# Altium schematic sheet SpW_Misc.SchDoc: SVPXFMC Carrier 3U
size 420 x 297 mm; CheckedBy: \; Author: G.Kasprowicz; CompanyName: ISE; DrawnBy: T.Przywozki; Organization: WUT ISE; Address1: Warsaw University of Technology; Address2: Nowowiejska 15/19 00-665 Warsaw; Revision: 1.0.; SheetNumber: 11; SheetTotal: 20; Project: SVPXFMC Carrier 3U; ModifiedBy: -; CheckedDate: -; Title2: FPGA SpaceWire; DivGrp: ISE; Designer: G. Kasprowicz
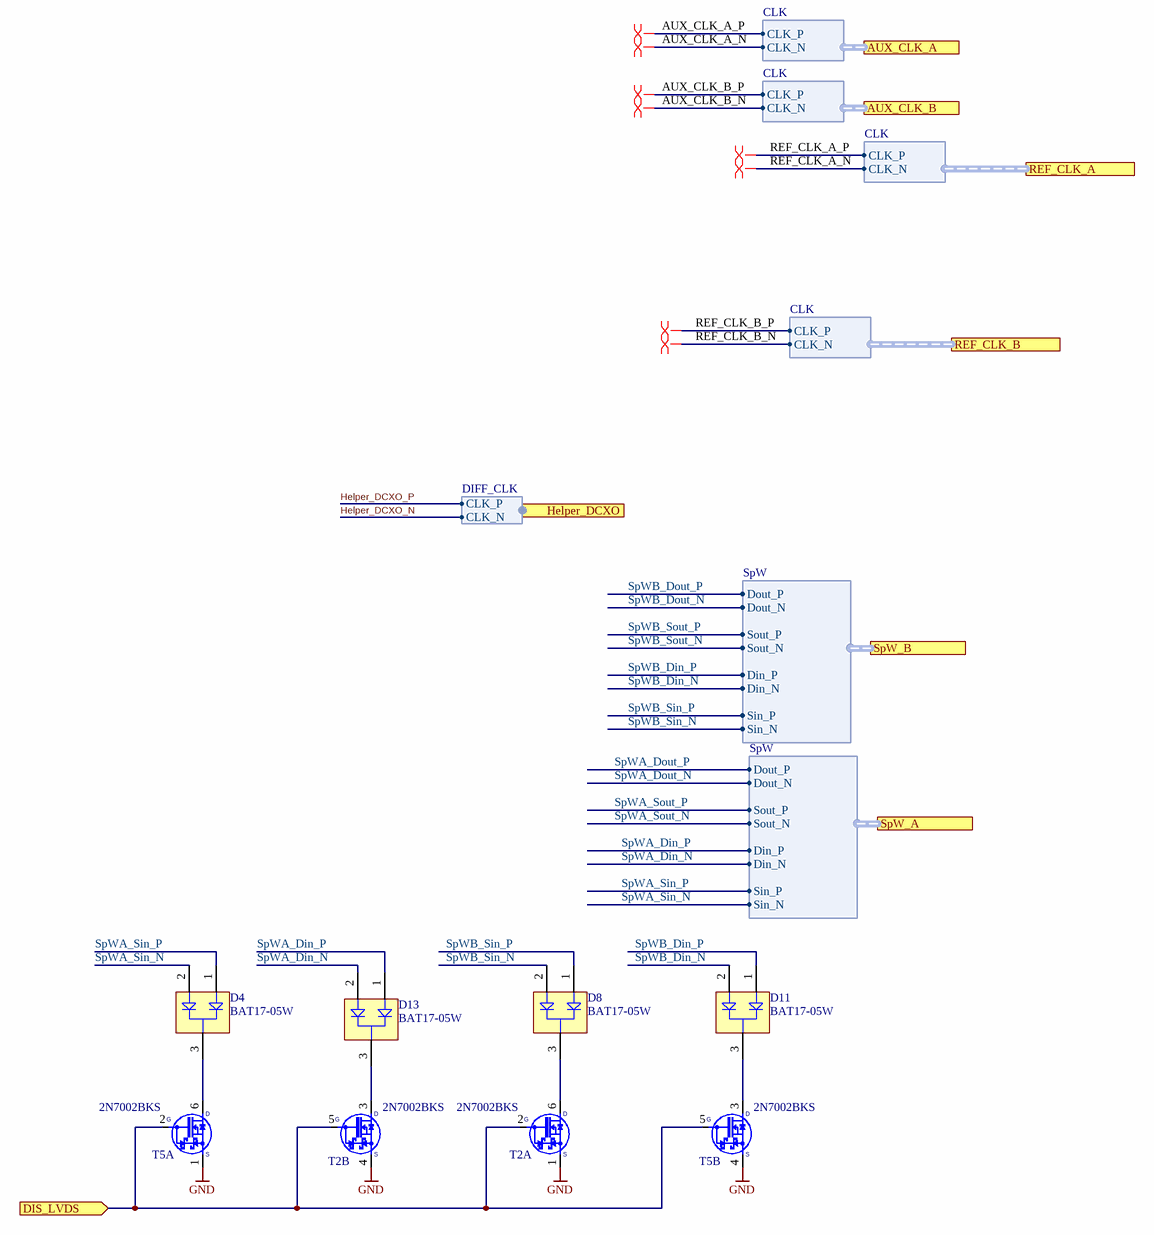
[diagram p0: SpW_Misc.SchDoc]

## Parts
D4  BAT17-05W  [INF-SOT323_N]
D8  BAT17-05W  [INF-SOT323_N]
D11  BAT17-05W  [INF-SOT323_N]
D13  BAT17-05W  [INF-SOT323_N]
T2  2N7002BKS  [SOT65P210X110-6N]  (parts A,B of 2)
T5  2N7002BKS  [SOT65P210X110-6N]  (parts A,B of 2)

## Ports
AUX_CLK_A (harness CLK), AUX_CLK_B (harness CLK), DIS_LVDS (in), Helper_DCXO (harness DIFF_CLK), REF_CLK_A (harness CLK), REF_CLK_B (harness CLK), SpW_A (harness SpW), SpW_B (harness SpW)

## Harnesses
SpW: Sout_P, Sout_N, Dout_P, Dout_N, Sin_P, Sin_N, Din_P, Din_N
CLK: CLK_P, CLK_N
DIFF_CLK: CLK_N, CLK_P

## Nets
GND: T2.1(S) T2.4(S) T5.1(S) T5.4(S)
AUX_CLK_A_N: port AUX_CLK_A.CLK_N
AUX_CLK_A_P: port AUX_CLK_A.CLK_P
AUX_CLK_B_N: port AUX_CLK_B.CLK_N
AUX_CLK_B_P: port AUX_CLK_B.CLK_P
DIS_LVDS: T2.2(G) T2.5(G) T5.2(G) T5.5(G) ; port DIS_LVDS
Helper_DCXO_N: port Helper_DCXO.CLK_N
Helper_DCXO_P: port Helper_DCXO.CLK_P
REF_CLK_A_N: port REF_CLK_A.CLK_N
REF_CLK_A_P: port REF_CLK_A.CLK_P
REF_CLK_B_N: port REF_CLK_B.CLK_N
REF_CLK_B_P: port REF_CLK_B.CLK_P
SpWA_Din_N: D13.2(A2) ; port SpW_A.Din_N
SpWA_Din_P: D13.1(A1) ; port SpW_A.Din_P
SpWA_Dout_N: port SpW_A.Dout_N
SpWA_Dout_P: port SpW_A.Dout_P
SpWA_Sin_N: D4.2(A2) ; port SpW_A.Sin_N
SpWA_Sin_P: D4.1(A1) ; port SpW_A.Sin_P
SpWA_Sout_N: port SpW_A.Sout_N
SpWA_Sout_P: port SpW_A.Sout_P
SpWB_Din_N: D11.2(A2) ; port SpW_B.Din_N
SpWB_Din_P: D11.1(A1) ; port SpW_B.Din_P
SpWB_Dout_N: port SpW_B.Dout_N
SpWB_Dout_P: port SpW_B.Dout_P
SpWB_Sin_N: D8.2(A2) ; port SpW_B.Sin_N
SpWB_Sin_P: D8.1(A1) ; port SpW_B.Sin_P
SpWB_Sout_N: port SpW_B.Sout_N
SpWB_Sout_P: port SpW_B.Sout_P
NetD4_3: D4.3(K) T5.6(D)
NetD8_3: D8.3(K) T2.6(D)
NetD11_3: D11.3(K) T5.3(D)
NetD13_3: D13.3(K) T2.3(D)

## Layout directives
differential pair: AUX_CLK_A_N, AUX_CLK_A_P, AUX_CLK_B_N, AUX_CLK_B_P, REF_CLK_A_N, REF_CLK_A_P, REF_CLK_B_N, REF_CLK_B_P

## Notes on the sheet
- Project/Equipment
- Document
- Designer
- Drawn by
- Check.by
- File
- Last Mod.
- Print Date
- Sheet
- Size
- A3
- of
- Rev
- Copyright WUT ISE 2019
  This documentation describes Open Hardware and is licensed under the CERN OHL v.1.1. You may redistribute and modify this documentation under the terms of the CERN OHL v1.1.
  (http://ohwr.org/CERNOHL). This documentation is dristributed WITHOUT ANY EXPRESS OR IMPLIED WARRANTY, INCLUDING OF MERCHANTABILITY, SATISFACTORY QUALITY AND FITNESS FOR A PARTICULAR PURPOSE. Please see the CERN OHL v.1.1 for applicable conditions

## Library data of the parts
D4 D8 D11 D13 = CMP-1154-00018-1: Dual Silicon Schottky Diode, 130 mA IF Max, SOT323, Green; Manufacturer: Infineon; VF (typ): 0.34 V; CT (typ): 0.55 pF; Green: yes; Group: RF Mixer; IF (max): 130 mA; VR (max): 4 V; ComponentLink1URL: http://www.infineon.com/; Mounting Technology: Surface Mount; Halogen-free: yes; DatasheetVersion: Jun-2011; ComponentLink3Description: Package Specification; ComponentLink2URL: http://www.infineon.com/dgdl/bat17series.pdf?folderId=db3a304314dca3890114ff6812070b44&fileId=db3a304314dca389011517d785d60d4e&location=en.Products.RF.RF_Mixer___Detector_Schottky_Diodes.DATASHEET.bat17series.pdf; PartNumber: BAT17-05W; ComponentLink3URL: http://www.infineon.com/dgdl/SOT323-Package_Overview.pdf?folderId=db3a30431936bc4b0119533e1dcb3c92&fileId=db3a30431936bc4b011953495f283cb1; Configuration: Dual; PackageDescription: 3-Pin Small Outline Transistor Package, 1.25 x 2 mm Body, 0.65 mm Pitch; ComponentLink1Description: Manufacturer URL; ComponentLink2Description: Datasheet; PackageReference: SOT323
T2 T5 = 2N7002BKS: 60V, 300mA Dual N-Channel Trench MOSFET; Manufacturer: NXP SEMICONDUCTORS; Manufacturer Part Number: 2N7002BKS6; PressFit: No; Bonding: No; Part Number: 2N7002BKS; Component Kind: Standard; Component Type: Standard; Device: 2N7002BKS; PackageDescription: SOT363, SC70-6, SOT, 0.65mm Pitch, 6 pin, 1.25mm W X 2.00mm L X 1.10mm H, IPC Medium Density; Part Description: 60 V, 300 mA Dual N-Channel Trench MOSFET; Pin Count: 4; Case: SOT363; Mounted: Yes; Socket: No; SMD: Yes; Sense: No; ComponentHeight: 1.1mm; HelpURL: \\cern.ch\dfs\Applications\Altium\Datasheets\2N7002BKS.pdf; Author: CERN DEM JLC; CreateDate: 2012-11-27; LatestRevisionDate: 2012-11-27